# EAGLE schematic Master (EAGLE 8.2.2)
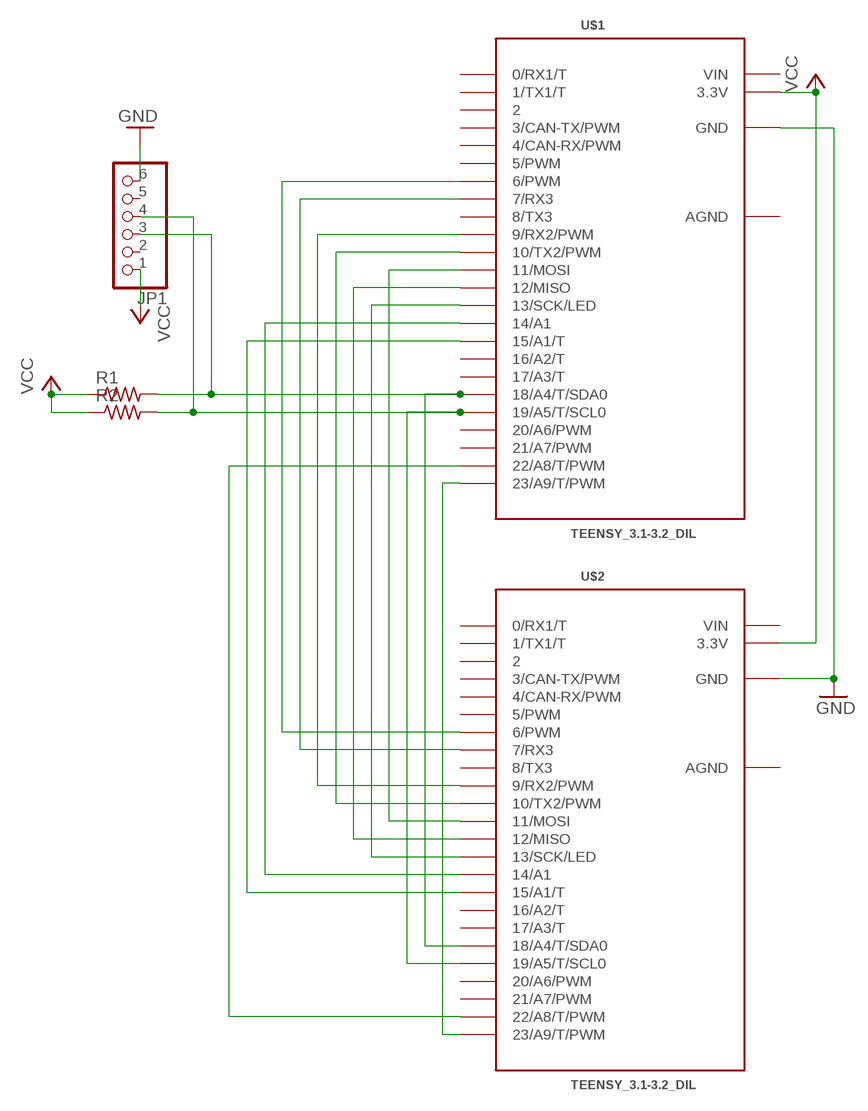
[diagram p0: schematic, sheet 1]

## Parts
JP1  PINHD-1X6  [1X06]
R1  R-US_0207/7  [0207/7]
R2  R-US_0207/7  [0207/7]
U$1  TEENSY_3.1-3.2_DIL  [TEENSY_3.0-3.2&LC_DIL]
U$2  TEENSY_3.1-3.2_DIL  [TEENSY_3.0-3.2&LC_DIL]

## Nets
GND: JP1.6 U$1.GND U$2.GND
N$2: JP1.3 R1.2 U$1.18/A4(18/A4/T/SDA0) U$2.18/A4(18/A4/T/SDA0)
N$3: JP1.4 R2.2 U$1.19/A5(19/A5/T/SCL0) U$2.19/A5(19/A5/T/SCL0)
N$5: U$1.11(11/MOSI) U$2.11(11/MOSI)
N$6: U$1.12(12/MISO) U$2.12(12/MISO)
N$7: U$1.10(10/TX2/PWM) U$2.10(10/TX2/PWM)
N$8: U$1.9(9/RX2/PWM) U$2.9(9/RX2/PWM)
N$9: U$1.7(7/RX3) U$2.7(7/RX3)
N$10: U$1.6(6/PWM) U$2.6(6/PWM)
N$11: U$1.13(13/SCK/LED) U$2.13(13/SCK/LED)
N$12: U$1.14/A0(14/A1) U$2.14/A0(14/A1)
N$13: U$1.15/A1(15/A1/T) U$2.15/A1(15/A1/T)
N$14: U$1.23/A9(23/A9/T/PWM) U$2.23/A9(23/A9/T/PWM)
N$15: U$1.22/A8(22/A8/T/PWM) U$2.22/A8(22/A8/T/PWM)
VCC: JP1.1 R1.1 R2.1 U$1.3.3V U$2.3.3V
Unconnected: JP1.2 JP1.5 U$1.0(0/RX1/T) U$1.1(1/TX1/T) U$1.2 U$1.3(3/CAN-TX/PWM) U$1.4(4/CAN-RX/PWM) U$1.5(5/PWM) U$1.8(8/TX3) U$1.16/A2(16/A2/T) U$1.17/A3(17/A3/T) U$1.20/A6(20/A6/PWM) U$1.21/A7(21/A7/PWM) U$2.0(0/RX1/T) U$2.1(1/TX1/T) U$2.2 U$2.3(3/CAN-TX/PWM) U$2.4(4/CAN-RX/PWM) U$2.5(5/PWM) U$2.8(8/TX3) U$2.16/A2(16/A2/T) U$2.17/A3(17/A3/T) U$2.20/A6(20/A6/PWM) U$2.21/A7(21/A7/PWM)

## Power pins joined to a net without a drawn wire
AGND: U$1.AGND U$2.AGND
VIN: U$1.VIN U$2.VIN

## Library data of the parts
JP1 = pinhead:PINHD-1X6: PIN HEADER
R1 R2 = rcl:R-US_: RESISTOR, American symbol
U$1 U$2 = Teensy_3_and_LC_Series_Boards_v1.4:TEENSY_3.1-3.2_DIL: Teensy 3.1 or 3.2 in a DIL Layout.